# EAGLE schematic Main PCB (EAGLE 8.6.0)
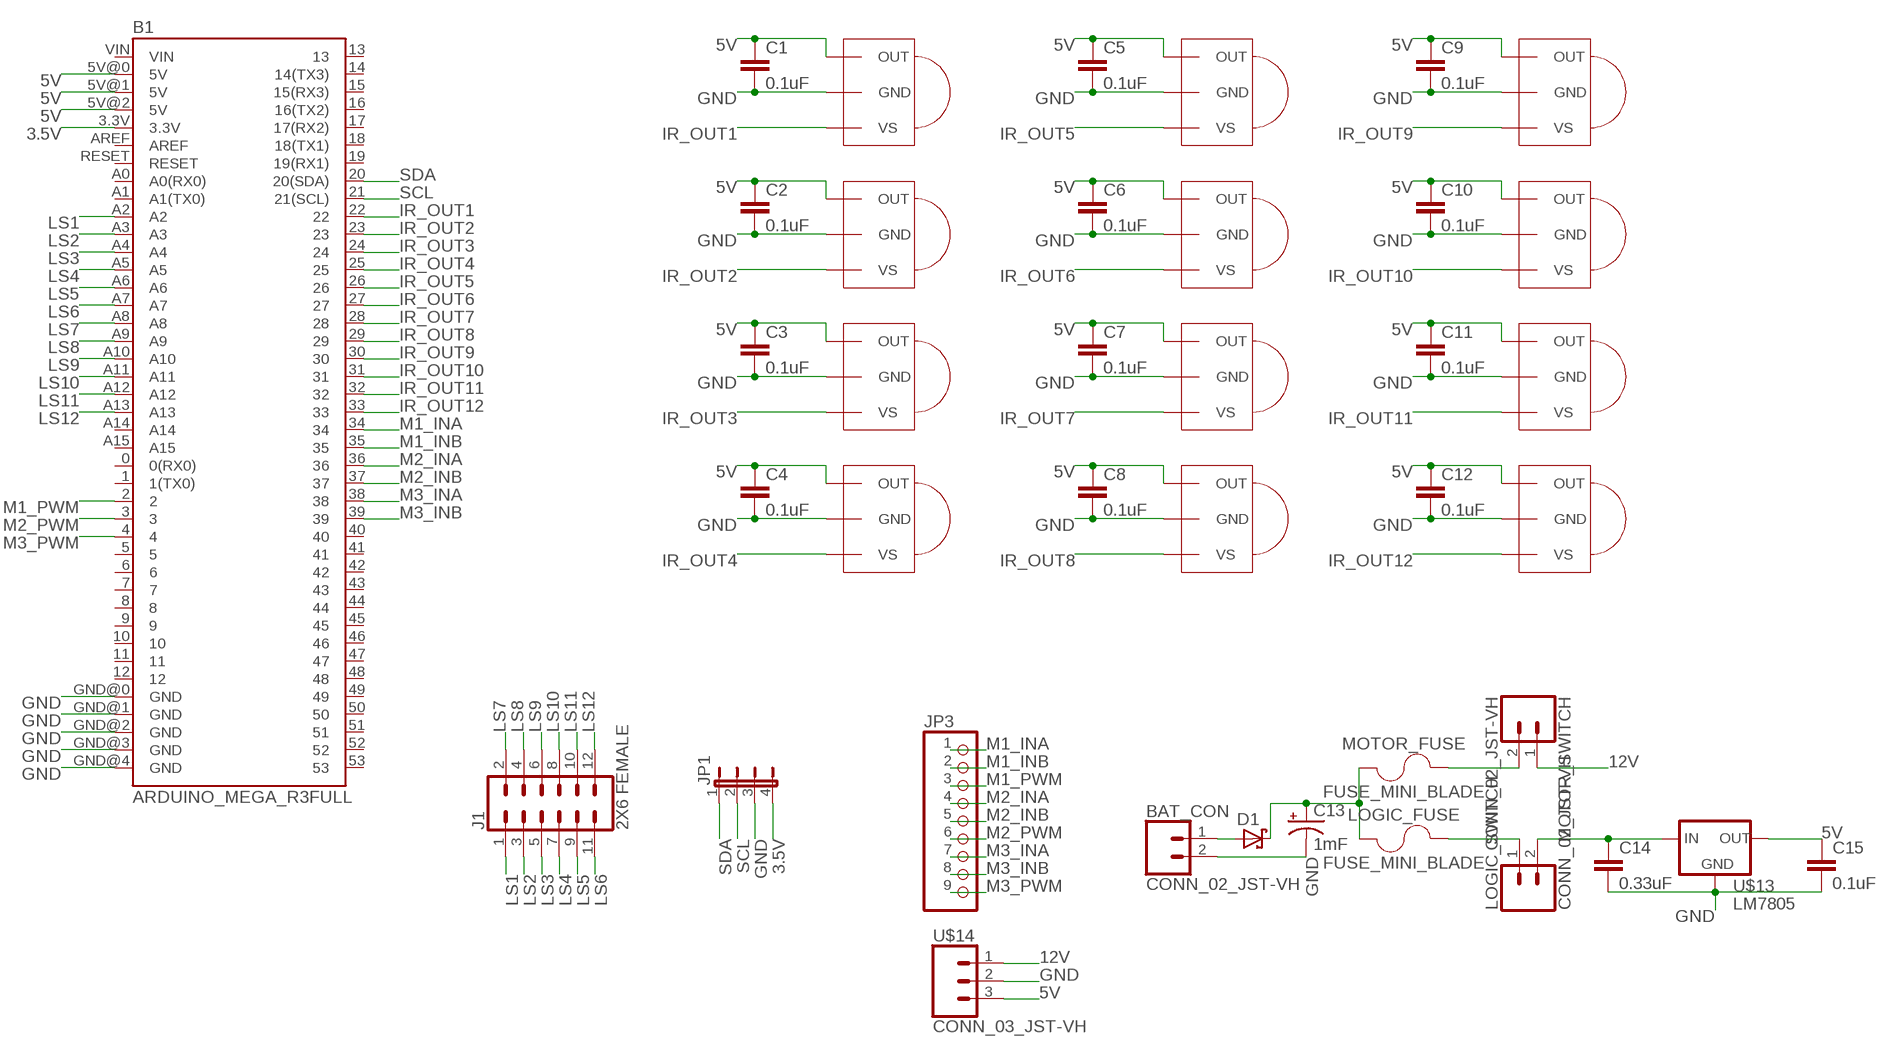
[diagram p0: schematic, sheet 1]

## Parts
B1  ARDUINO_MEGA_R3FULL  [ARDUINO_MEGA]
BAT_CON  CONN_02_JST-VH  [B2P-VH]
C1  0.1uF  0.1UF-0603-25V-(+80/-20%)  [0603]
C2  0.1uF  0.1UF-0603-25V-(+80/-20%)  [0603]
C3  0.1uF  0.1UF-0603-25V-(+80/-20%)  [0603]
C4  0.1uF  0.1UF-0603-25V-(+80/-20%)  [0603]
C5  0.1uF  0.1UF-0603-25V-(+80/-20%)  [0603]
C6  0.1uF  0.1UF-0603-25V-(+80/-20%)  [0603]
C7  0.1uF  0.1UF-0603-25V-(+80/-20%)  [0603]
C8  0.1uF  0.1UF-0603-25V-(+80/-20%)  [0603]
C9  0.1uF  0.1UF-0603-25V-(+80/-20%)  [0603]
C10  0.1uF  0.1UF-0603-25V-(+80/-20%)  [0603]
C11  0.1uF  0.1UF-0603-25V-(+80/-20%)  [0603]
C12  0.1uF  0.1UF-0603-25V-(+80/-20%)  [0603]
C13  1mF  1000UF-RADIAL-5MM-25V-20%  [CPOL-RADIAL-5MM-10MM]
C14  0.33uF  C5/3  [C5B3]
C15  0.1uF  C5/3  [C5B3]
D1  SCHOTTKY-DIODEP6T15  [P6T15]
J1  2X6 FEMALE  CONN_06X2PTH_FEMALE  [2X6]
JP1  JP4E  [JP4]
JP3  PINHD-1X9  [1X09]
LOGIC_FUSE  FUSE_MINI_BLADE  [SL-1538]
LOGIC_SWITCH  CONN_02_JST-VH  [B2P-VH]
MOTOR_FUSE  FUSE_MINI_BLADE  [SL-1538]
MOTOR_SWITCH  CONN_02_JST-VH  [B2P-VH]
U$1  TSSP58038  [MINICAST]
U$2  TSSP58038  [MINICAST]
U$3  TSSP58038  [MINICAST]
U$4  TSSP58038  [MINICAST]
U$5  TSSP58038  [MINICAST]
U$6  TSSP58038  [MINICAST]
U$7  TSSP58038  [MINICAST]
U$8  TSSP58038  [MINICAST]
U$9  TSSP58038  [MINICAST]
U$10  TSSP58038  [MINICAST]
U$11  TSSP58038  [MINICAST]
U$12  TSSP58038  [MINICAST]
U$13  LM7805  [TO220-ADJ]
U$14  CONN_03_JST-VH  [B3P-VH]

## Nets
3.5V: B1.3.3V JP1.4
5V: B1.5V@0(5V) B1.5V@1(5V) B1.5V@2(5V) C1.1 C2.1 C3.1 C4.1 C5.1 C6.1 C7.1 C8.1 C9.1 C10.1 C11.1 C12.1 C15.1 U$1.1(OUT) U$2.1(OUT) U$3.1(OUT) U$4.1(OUT) U$5.1(OUT) U$6.1(OUT) U$7.1(OUT) U$8.1(OUT) U$9.1(OUT) U$10.1(OUT) U$11.1(OUT) U$12.1(OUT) U$13.OUTPUT(OUT) U$14.3
12V: MOTOR_SWITCH.1 U$14.1
GND: B1.GND@0(GND) B1.GND@1(GND) B1.GND@2(GND) B1.GND@3(GND) B1.GND@4(GND) BAT_CON.2 C1.2 C2.2 C3.2 C4.2 C5.2 C6.2 C7.2 C8.2 C9.2 C10.2 C11.2 C12.2 C13.- C14.2 C15.2 JP1.3 U$1.2(GND) U$2.2(GND) U$3.2(GND) U$4.2(GND) U$5.2(GND) U$6.2(GND) U$7.2(GND) U$8.2(GND) U$9.2(GND) U$10.2(GND) U$11.2(GND) U$12.2(GND) U$13.GND U$14.2
IR_OUT1: B1.22 U$1.3(VS)
IR_OUT2: B1.23 U$2.3(VS)
IR_OUT3: B1.24 U$3.3(VS)
IR_OUT4: B1.25 U$4.3(VS)
IR_OUT5: B1.26 U$5.3(VS)
IR_OUT6: B1.27 U$6.3(VS)
IR_OUT7: B1.28 U$7.3(VS)
IR_OUT8: B1.29 U$8.3(VS)
IR_OUT9: B1.30 U$9.3(VS)
IR_OUT10: B1.31 U$10.3(VS)
IR_OUT11: B1.32 U$11.3(VS)
IR_OUT12: B1.33 U$12.3(VS)
LS1: B1.A2 J1.1
LS2: B1.A3 J1.3
LS3: B1.A4 J1.5
LS4: B1.A5 J1.7
LS5: B1.A6 J1.9
LS6: B1.A7 J1.11
LS7: B1.A8 J1.2
LS8: B1.A9 J1.4
LS9: B1.A10 J1.6
LS10: B1.A11 J1.8
LS11: B1.A12 J1.10
LS12: B1.A13 J1.12
M1_INA: B1.34 JP3.1
M1_INB: B1.35 JP3.2
M1_PWM: B1.2 JP3.3
M2_INA: B1.36 JP3.4
M2_INB: B1.37 JP3.5
M2_PWM: B1.3 JP3.6
M3_INA: B1.38 JP3.7
M3_INB: B1.39 JP3.8
M3_PWM: B1.4 JP3.9
N$1: BAT_CON.1 D1.A
N$2: LOGIC_FUSE.P$2 LOGIC_SWITCH.1
N$3: C13.+ D1.C LOGIC_FUSE.P$1 MOTOR_FUSE.P$1
N$4: MOTOR_FUSE.P$2 MOTOR_SWITCH.2
N$5: C14.1 LOGIC_SWITCH.2 U$13.INPUT(IN)
SCL: B1.21(21(SCL)) JP1.2
SDA: B1.20(20(SDA)) JP1.1
Unconnected: B1.0(0(RX0)) B1.1(1(TX0)) B1.5 B1.6 B1.7 B1.8 B1.9 B1.10 B1.11 B1.12 B1.13 B1.14(14(TX3)) B1.15(15(RX3)) B1.16(16(TX2)) B1.17(17(RX2)) B1.18(18(TX1)) B1.19(19(RX1)) B1.40 B1.41 B1.42 B1.43 B1.44 B1.45 B1.46 B1.47 B1.48 B1.49 B1.50 B1.51 B1.52 B1.53 B1.A0(A0(RX0)) B1.A1(A1(TX0)) B1.A14 B1.A15 B1.AREF B1.RESET B1.VIN

## Library data of the parts
B1 = SparkFun-Boards:ARDUINO_MEGA_R3: Arduino Mega R3 ATmega2560 R3 compatible footprint. SparkFun Products: Arduino Mega 2560 R3 <https://www.sparkfun.com/products/11061>
BAT_CON LOGIC_SWITCH MOTOR_SWITCH = JST-VH:CONN_02_JST-VH: B2P-VH(LF)(SN) Digikey <https://www.digikey.com.au/product-detail/en/jst-sales-america-inc/B2P-VH-LF-SN/455-1639-ND/926547>
C1-C12 = SparkFun-Capacitors:0.1UF: 0.1µF ceramic capacitors A capacitor is a passive two-terminal electrical component used to store electrical energy temporarily in an electric field.; PROD_ID: CAP-00810
C13 = SparkFun-Capacitors:1000UF: 1,000µF/1mF ceramic capacitors A capacitor is a passive two-terminal electrical component used to store electrical energy temporarily in an electric field. CAP-08070; PROD_ID: CAP-09538
C14 C15 = capacitor-wima:C: CAPACITOR naming: grid - package width
D1 = diode:SCHOTTKY-DIODE: Schottky Diode
J1 = SparkFun-Connectors:CONN_06X2: Multi connection point. Often used as Generic Header-pin footprint for 0.1 inch spaced/style header connections On any of the 0.1 inch spaced packages, you can populate with these: Break Away Headers - Straight <https://www.sparkfun.com/products/116> (PRT-00116) Break Away Male Headers - Right Angle <https://www.sparkfun.com/products/553> (PRT-00553) Female Headers <https://www.sparkfun.com/products/115> (PRT-00115) Break Away Headers - Machine Pin <https://www.sparkfun.com/products/117> (PRT-00117) Break Away Female Headers - Swiss Machine Pin <https://www.sparkfun.com/products/743> (PRT-00743); PROD_ID: CONN-12423
JP1 = jumper:JP4E: JUMPER
JP3 = pinhead:PINHD-1X9: PIN HEADER
LOGIC_FUSE MOTOR_FUSE = Fuse_Holder:FUSE_MINI_BLADE: SL-1538 Aliexpress <https://www.aliexpress.com/item/SL-1538-MINI-Style-Blade-Fuse-Holers-PCB-Mount-Fuse-holders-0153008/503553051.html>
U$1-U$12 = IR Receivers:TSSP58038: IR Receiver Module for Light Barrier Systems datasheet <http://www.vishay.com/docs/82479/tssp58038.pdf>
U$13 = LM7805:LM7805
U$14 = JST-VH:CONN_03_JST-VH: B3P-VH(LF)(SN) Digikey <https://www.digikey.com.au/products/en?keywords=455-1640-ND>